# EAGLE design MagMemsAmpli_V6 (EAGLE 9.6.2)
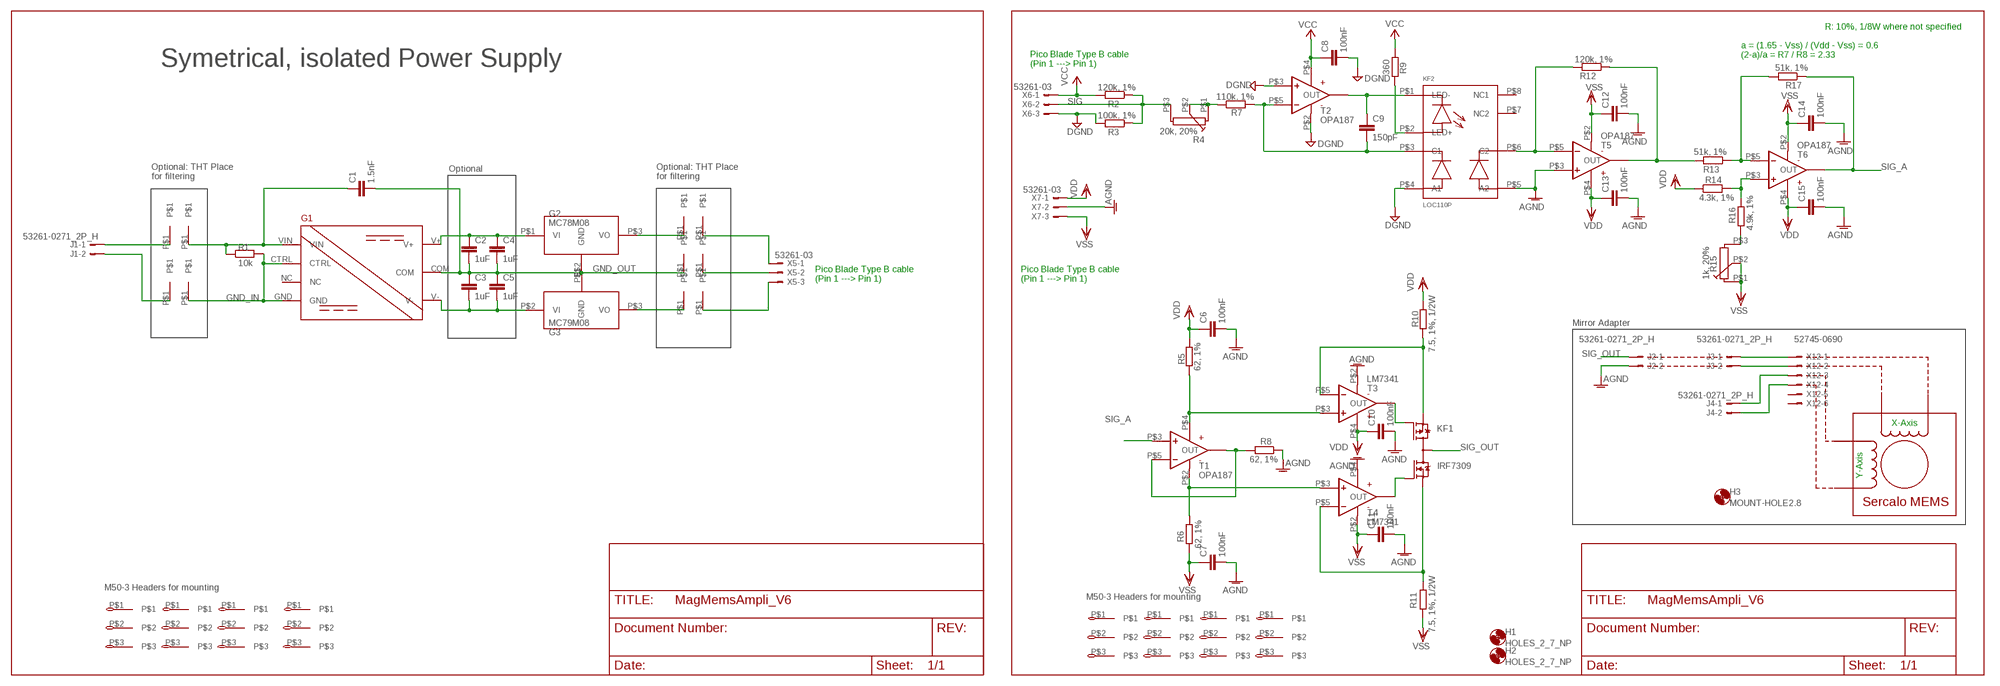
[diagram p0: schematic, sheet 1]

## Parts
C1  1.5nF  C-EUC0805K  [C0805K]
C2  1uF  C-EUC0805K  [C0805K]
C3  1uF  C-EUC0805K  [C0805K]
C4  1uF  C-EUC0805K  [C0805K]
C5  1uF  C-EUC0805K  [C0805K]
C6  100nF  C-EUC0603K  [C0603K]
C7  100nF  C-EUC0603K  [C0603K]
C8  100nF  C-EUC0603K  [C0603K]
C9  150pF  C-EUC0603K  [C0603K]
C10  100nF  C-EUC0603K  [C0603K]
C11  100nF  C-EUC0603K  [C0603K]
C12  100nF  C-EUC0603K  [C0603K]
C13  100nF  C-EUC0603K  [C0603K]
C14  100nF  C-EUC0603K  [C0603K]
C15  100nF  C-EUC0603K  [C0603K]
G1  RS6-0512D  [RS_THT]
G2  MC78M08  [DPAK-3]
G3  MC79M08  [DPAK-3]
H1  HOLES_2_7_NP  [2_7_NP]
H2  HOLES_2_7_NP  [2_7_NP]
H3  MOUNT-HOLE2.8  [2,8]
J1  53261-0271_2P_H  [53261-02]
J2  53261-0271_2P_H  [53261-02]
J3  53261-0271_2P_H  [53261-02]
J4  53261-0271_2P_H  [53261-02]
KF1  IRF7309  [SO08-IRF]
KF2  LOC110P  [LOC110P]
R1  10k  R-EU_R0603  [R0603]
R2  120k, 1%  R-EU_R0603  [R0603]
R3  100k, 1%  R-EU_R0603  [R0603]
R4  20k, 20%  SM-3T  [SM-3T]
R5  62, 1%  R-EU_R0603  [R0603]
R6  62, 1%  R-EU_R0603  [R0603]
R7  110k, 1%  R-EU_R0603  [R0603]
R8  62, 1%  R-EU_R0603  [R0603]
R9  360  R-EU_R0603  [R0603]
R10  7.5, 1%, 1/2W  R-EU_R0805  [R0805]
R11  7.5, 1%, 1/2W  R-EU_R0805  [R0805]
R12  120k, 1%  R-EU_R0603  [R0603]
R13  51k, 1%  R-EU_R0603  [R0603]
R14  4.3k, 1%  R-EU_R0603  [R0603]
R15  1k, 20%  SM-3T  [SM-3T]
R16  4.9k, 1%  R-EU_R0603  [R0603]
R17  51k, 1%  R-EU_R0603  [R0603]
T1  OPA187  [SOT23-5]
T2  OPA187  [SOT23-5]
T3  LM7341  [SOT23-5]
T4  LM7341  [SOT23-5]
T5  OPA187  [SOT23-5]
T6  OPA187  [SOT23-5]
TP1  TP10  [TP10]
TP2  TP10  [TP10]
TP3  TP10  [TP10]
TP4  TP10  [TP10]
TP5  TP10  [TP10]
TP6  TP10  [TP10]
TP7  TP10  [TP10]
TP8  TP10  [TP10]
TP9  TP10  [TP10]
TP10  TP10  [TP10]
X1  M50-3  [M50-3]
X2  M50-3  [M50-3]
X3  M50-3  [M50-3]
X4  M50-3  [M50-3]
X5  53261-03  [53261-03]
X6  53261-03  [53261-03]
X7  53261-03  [53261-03]
X8  M50-3  [M50-3]
X9  M50-3  [M50-3]
X10  M50-3  [M50-3]
X11  M50-3  [M50-3]
X12  52745-0690  [52745-0690]

## Nets
AGND [Thick]: C6.2 C7.2 C10.2 C11.2 C12.2 C13.2 C14.2 C15.2 J2.2 KF2.P$5(A2) R8.1 T3.P$2(V-) T4.P$4(V+) T5.P$3(+IN) X7.2
DGND [Thick]: C8.2 KF2.P$4(A1) R3.2 T2.P$2(V-) T2.P$3(+IN) X6.3
GND_IN [Thick]: G1.CTRL G1.GND R1.2 TP4.P$1
GND_OUT [Thick]: C1.2 C2.2 C3.1 C4.2 C5.1 G1.COM G2.P$2(GND) G3.P$1(GND) TP6.P$1
N$1 [Thick]: C1.1 G1.VIN R1.1 TP3.P$1
N$2 [Thick]: C2.1 C4.1 G1.V+ G2.P$1(VI)
N$3 [Thick]: C3.2 C5.2 G1.V- G3.P$2(VI)
N$4 [Thick]: J1.1 TP1.P$1
N$5: J1.2 TP2.P$1
N$6: C9.1 KF2.P$1(LED-) T2.P$1(OUT)
N$7: KF2.P$2(LED+) R9.1
N$9: R13.1 R17.2 T6.P$5(-IN)
N$10: R12.1 R13.2 T5.P$1(OUT)
N$11: C9.2 KF2.P$3(C1) R7.2 T2.P$5(-IN)
N$12: KF2.P$6(C2) R12.2 T5.P$5(-IN)
N$13: R14.2 R16.2 T6.P$3(+IN)
N$15: G2.P$3(VO) TP5.P$1
N$16: G3.P$3(VO) TP7.P$1
N$17: TP8.P$1 X5.1
N$18: TP9.P$1 X5.2
N$19: TP10.P$1 X5.3
N$30: KF1.3(P-S) R10.1 T3.P$5(-IN)
N$31: KF1.4(P-G) T3.P$1(OUT)
N$32: KF1.2(N-G) T4.P$1(OUT)
N$33: KF1.1(N-S) R11.2 T4.P$5(-IN)
N$34: R8.2 T1.P$1(OUT) T1.P$5(-IN)
N$35: R6.2 T1.P$2(V-) T4.P$3(+IN)
N$36: R5.1 T1.P$4(V+) T3.P$3(+IN)
N$46 [Thin]: J3.1 X12.1
N$47 [Thin]: J3.2 X12.2
N$48 [Thin]: J4.1 X12.3
N$49 [Thin]: J4.2 X12.4
N$59: R4.P$1(1A) R4.P$2(1S) R7.1
N$60: R15.P$3(1E) R16.1
SIG: R2.1 R3.1 R4.P$3(1E) X6.2
SIG_A: R17.1 T1.P$3(+IN) T6.P$1(OUT)
SIG_OUT: J2.1 KF1.5(D) KF1.6(D) KF1.7(D) KF1.8(D)
VCC [Thick]: C8.1 R2.2 R9.2 T2.P$4(V+) X6.1
VDD [Thick]: C6.1 C10.1 C13.1 C15.1 R5.2 R10.2 R14.1 T3.P$4(V+) T5.P$4(V+) T6.P$4(V+) X7.1
VSS [Thick]: C7.1 C11.1 C12.1 C14.1 R6.1 R11.1 R15.P$1(1A) R15.P$2(1S) T4.P$2(V-) T5.P$2(V-) T6.P$2(V-) X7.3
Unconnected: G1.NC KF2.P$7(NC2) KF2.P$8(NC1) X1.P$1 X1.P$2 X1.P$3 X2.P$1 X2.P$2 X2.P$3 X3.P$1 X3.P$2 X3.P$3 X4.P$1 X4.P$2 X4.P$3 X8.P$1 X8.P$2 X8.P$3 X9.P$1 X9.P$2 X9.P$3 X10.P$1 X10.P$2 X10.P$3 X11.P$1 X11.P$2 X11.P$3 X12.5 X12.6

## Notes on the sheet
- R: 10%, 1/8W where not specified
- a = (1.65 - Vss) / (Vdd - Vss) = 0.6
- (2-a)/a = R7 / R8 = 2.33
- Symetrical, isolated Power Supply
- Pico Blade Type B cable
  (Pin 1 ---> Pin 1)
- Optional: THT Place | Optional | Optional: THT Place
- for filtering | for filtering
- Pico Blade Type B cable
  (Pin 1 ---> Pin 1)
- Pico Blade Type B cable
  (Pin 1 ---> Pin 1)
- Mirror Adapter
- X-Axis
- Y-Axis
- M50-3 Headers for mounting
- M50-3 Headers for mounting

## Library data of the parts
C1 = rcl:C-EU: CAPACITOR, European symbol; MOUSER: 0805B152K500CT; PREIS: 0.117; SPICEPREFIX: C
C2-C4 = rcl:C-EU: CAPACITOR, European symbol; MOUSER: 0805B105K500CT; PREIS: 0.199; SPICEPREFIX: C
C5 = rcl:C-EU: CAPACITOR, European symbol; MOUSER: 0805B105K500CT; SPICEPREFIX: C
C6-C8 C10-C15 = rcl:C-EU: CAPACITOR, European symbol; MOUSER: 06033C104KAT4A; PREIS: 0.082; SPICEPREFIX: C
C9 = rcl:C-EU: CAPACITOR, European symbol; MOUSER: C0603C101M5HACTU; PREIS: 0.092; SPICEPREFIX: C
G1 = tud1_eagle_lib:RS6-0512D; IOUT: +-250mA; MANUFACTURER: Recom Power; MOUSER: 919-RS6-0512D; PACKAGE: THT; PREIS: 13.92; TEMP: -40 to 85 deg; UIN: 4.5V-9V; UOUT: +-12V
G2 = tud1_eagle_lib:MC78M08; MOUSER: MC78M08CDTG; PREIS: 0.375
G3 = tud1_eagle_lib:MC79M08; MOUSER: MC79M08CDTG; PREIS: 0.503
H1 H2 = tud1_eagle_lib:HOLES_2_7_NP: Hole D = 2,7mm
H3 = holes:MOUNT-HOLE: MOUNTING HOLE with drill center marker
J1-J4 = tud1_eagle_lib:53261-0271_2P_H: Pin header, PicoBlade 2-pin SMD, 53261-0271, Molex, single row 90, Distrelec : 143-54-270; CABLE_ASSEMBLY_31565: Distrelec : 143-54-490; CONTACT_MATERIAL: Tin-plated phosphor bronze; CONTACT_RESISTANCE: 20mOhm; CRIMP_SOCKET_FEMALE_32-28AWG_50058-8100: Distrelec : 143-00-962; CRIMP_SOCKET_FEMALE__28-26AWG_50079-8100: Distrelec : 143-00-964; DESIGN: Pin strip, single row 90° SMD; DISTRELEC: 143-54-270; MANUFACTURER: Molex; MOUSER: 538-53261-0271; PITCH: 1.25mm; POLE-NO: 2; PREIS: 0.84; RATED-CURRENT: 1A; RATED-VOLTAGE: 125VAC; SERIES: PicoBlade; SOCKET_51021-0200: Distrelec : 143-54-361
KF1 = tud1_eagle_lib:IRF7309: Complimentary Half Bridge HEXFET Power MOSFET Source: http://www.irf.com/product-info/datasheets/data/irf7389.pdf; CHANNELS: N / P; FREILAUFDIODE: YES; IDS: 4A; MANUFACTUR: Infineon; MOUSER: 942-IRF7309TRPBF; PACKAGE: SO-8; PD: 1.4W; PREIS: 0.667; TECH: SS-MOSFET; VDS: 30V
KF2 = tud1_eagle_lib:LOC110P; MOUESR: 849-LOC110P; PREIS: 2.41
R1 = rcl:R-EU_: RESISTOR, European symbol; MOUSER: ESR03EZPF62R0; PREIS: 0.147; SPICEPREFIX: R
R2 R12 = rcl:R-EU_: RESISTOR, European symbol; MOUSER: MCT06030C1203FP500; PREIS: 0.092; SPICEPREFIX: R
R3 = rcl:R-EU_: RESISTOR, European symbol; MOUSER: MCT06030C1003FP500; PREIS: 0.12; SPICEPREFIX: R
R4 = tud1_eagle_lib:SM-3T; MOUSER: SM-3TW203; PREIS: 3.06; TURNS: 11
R5 R6 R8 = rcl:R-EU_: RESISTOR, European symbol; MOUSER: ESR03EZPF62R0; PREIS: 0.119; SPICEPREFIX: R
R7 = rcl:R-EU_: RESISTOR, European symbol; MOUSER: CRCW0603110KFKEAC; PREIS: 0.12; SPICEPREFIX: R
R9 = rcl:R-EU_: RESISTOR, European symbol; MOUSER: MR06X3600FTL; PREIS: 0.12; SPICEPREFIX: R
R10 R11 = rcl:R-EU_: RESISTOR, European symbol; MOUSER: ESR10EZPF7R50; PREIS: 0.147; SPICEPREFIX: R
R13 R17 = rcl:R-EU_: RESISTOR, European symbol; MOUSER: MCT06030C5102FP500; PREIS: 0.137; SPICEPREFIX: R
R14 = rcl:R-EU_: RESISTOR, European symbol; MOUSER: SDR03EZPF4301; PREIS: 0.129; SPICEPREFIX: R
R15 = tud1_eagle_lib:SM-3T; MOUSER: SM-3TW102; PREIS: 3.06; TURNS: 11
R16 = rcl:R-EU_: RESISTOR, European symbol; MOUSER: MCT0603MC4701FP500; PREIS: 0.092; SPICEPREFIX: R
T1 T2 T5 T6 = tud1_eagle_lib:OPA187; GBP: 14MHz; IOUT: +130mA; MANUFACTUR: TI; MOUSER: 595-OPA187IDBVR; OUTPUT_RANGE: Rail-To-Rail; PREIS: 2.06; RUHESTROM: 100uA; TEMO: -40 to 125 deg; VB: +-18V; VCM: Rail-to-Rail
T3 T4 = tud1_eagle_lib:LM7341; GBP: 4MHz; INPUT_RANGE: Rail-To-Rail; MANUFACTUR: TI; MOUSER: 926-LM7341MF/NOPB; OUTPUT_RANGE: Rail-To-Rail; PACKAGE: SOT23-5; PREIS: 2.37; RUHESTROM: 700uA; UMAX: 32V
TP1-TP10 = tud1_eagle_lib:TP10
X1-X4 = tud1_eagle_lib:M50-3; MOUSER: M50-3030342; PREIS: 0.558; TYPE: FEMALE
X5-X7 = con-molex:53?-03: CONNECTOR wire to board 1.25 mm (.049 inch) pitch header; MF: MOLEX; MOUSER: 53261-0371; MPN: 53261-0390; OC_FARNELL: 1125359; OC_NEWARK: 57H5006; PREIS: 0.52
X8-X11 = tud1_eagle_lib:M50-3; MOUSER: M50-3530342; PREIS: 0.137; TYPE: MALE
X12 = con-molex:52745-0690: FFC/FPC-to-Board 0.50mm (.020") SMT Top Contact Right Angle, ZIF, Style Receptacle 52745 / 52435 Source: http://www.molex.com/product/ffc/52745.html; MF: MOLEX; MOUSER: 52745-0697; MPN: 52745-0690; OC_FARNELL: unknown; OC_NEWARK: 92M6374; PREIS: 0.796

## Net classes
0 default: width 0.2 mm, drill 0.3 mm, clearance 0.15 mm
2 Thick: width 0.4 mm, drill 0.6 mm, clearance 0.3 mm
3 Thin: width 0.2 mm, drill 0.3 mm, clearance 0.15 mm

## Board
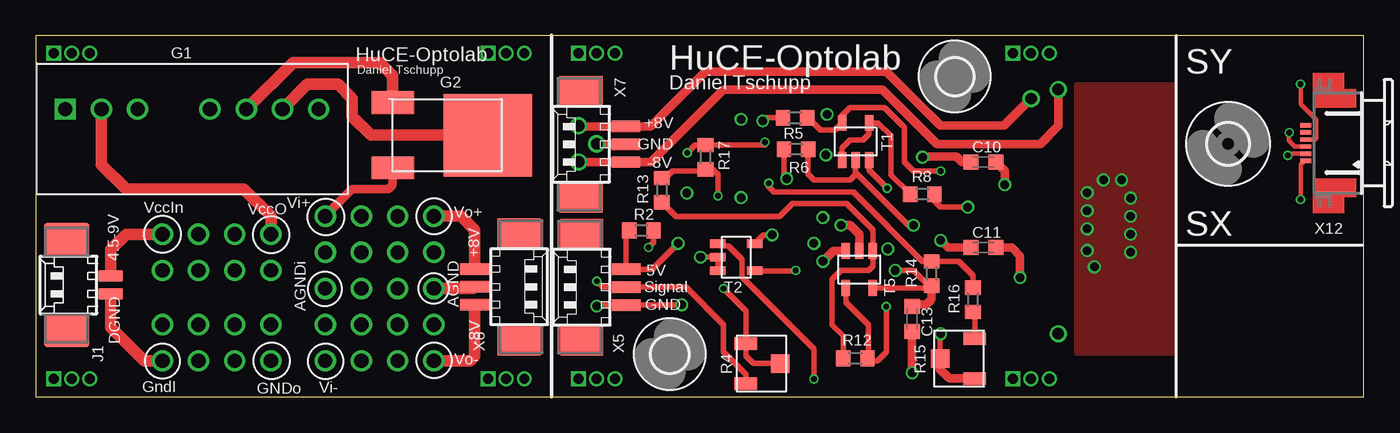
[diagram p1: board, top side]
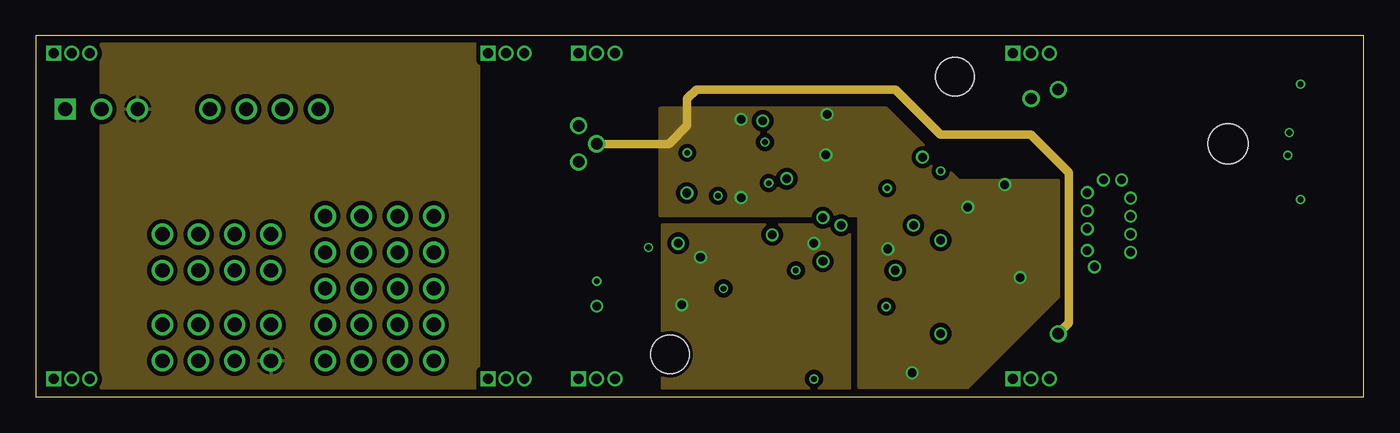
[diagram p2: board, inner layer Route2]
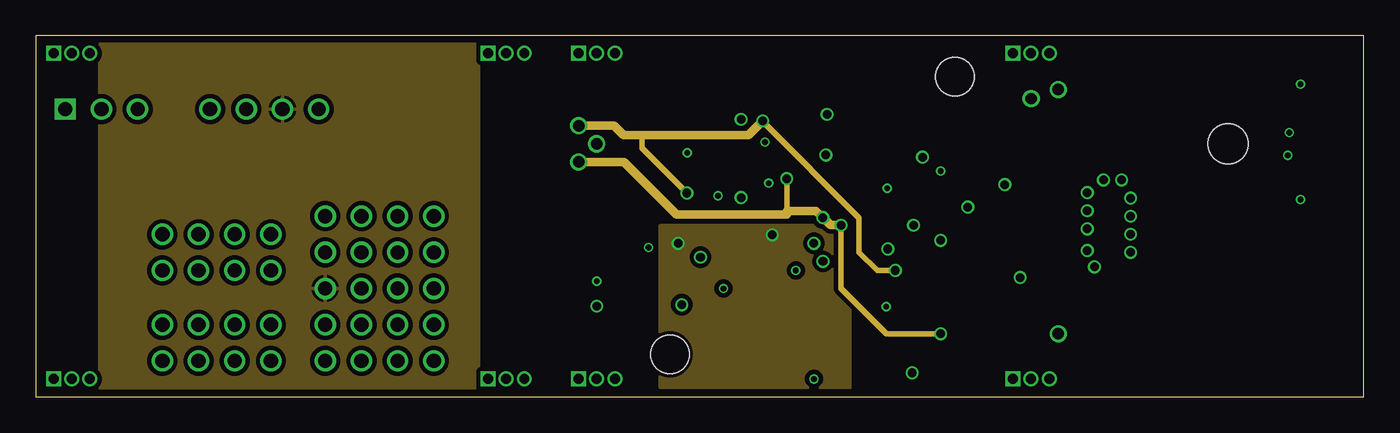
[diagram p3: board, inner layer Route3]
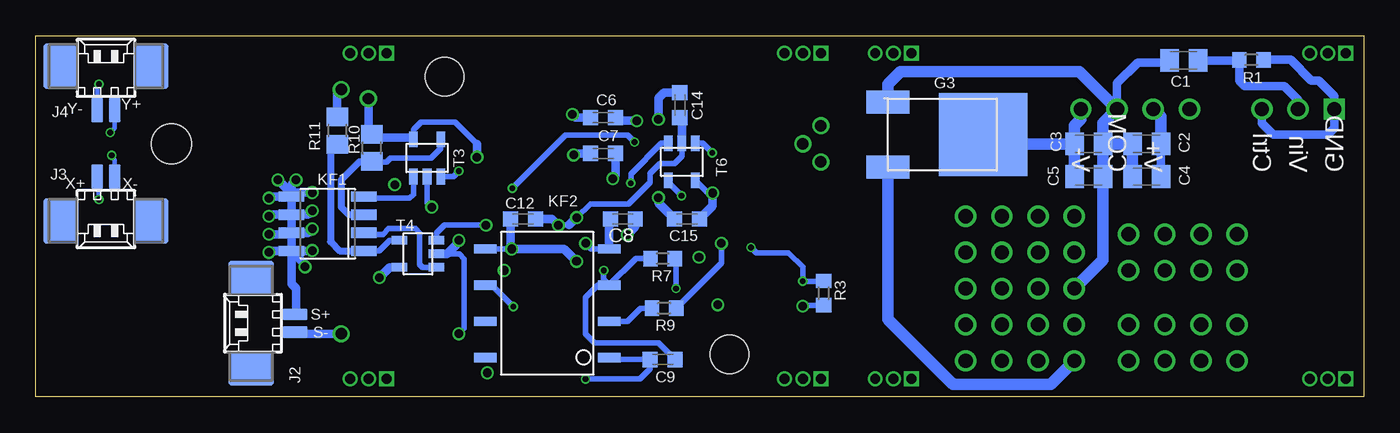
[diagram p4: board, bottom side, seen from below]

Size 93.2 x 25.38 mm. Coordinates in mm from the lower left corner, seen from the top.
Outline: 0,0 93.2,0 93.2,25.38 0,25.38 0,0
Copper layers (1+2*3+16): Top 0.018mm / dielectric 0.36mm / Route2 0.035mm / dielectric 0.71mm / Route3 0.035mm / dielectric 0.36mm / Bottom 0.018mm
Design rules "eC_4Layer_PClass6_BaseCopperO18-I35_eCDefault *": minimum track width 0.15mm, minimum drill 0.35mm, track to track 0.15mm, track to pad 0.15mm, pad to pad 0.15mm, via to via 0.15mm, smd to smd 0mil, copper to edge 0.25mm, drill to drill 0.35mm, minimum pad ring 0.175mm, minimum via ring 0.125mm, stop-mask expansion 0mil, vias tented up to drill 0.45mm, thermal gap 0.2mm

### Footprints (pad centres in the part's own frame; a part is rotated, then mirrored left to right if it is on the bottom)
C0805K = smd 1.3 x 1.6: 1 -1,0; 2 1,0
C0603K = smd 1.05 x 1.08: 1 -0.875,0; 2 0.875,0
RS_THT = drill 1: COM 15.24,0; CTRL 5.08,0; NC 10.16,0; V+ 12.7,0; V- 17.78,0; VIN 2.54,0 | drill 1 square: GND 0,0
DPAK-3 = smd 1.6 x 3: P$1 -2.285,-2.29; P$3 2.285,-2.29 | smd 5.8 x 6.2: P$2 0,4.39
2_7_NP = hole 2.7: 0,0
2,8 = hole 2.8: 0,0
53261-02 = smd 0.8 x 1.7: 1 0.625,-2.35; 2 -0.625,-2.35 | smd 2.3 x 3.2: S1 3.225,0.75; S2 -3.225,0.75
SO08-IRF = smd 0.72 x 1.78: 1 -1.905,-2.543; 2 -0.635,-2.543; 3 0.635,-2.543; 4 1.905,-2.543; 5 1.905,2.543; 6 0.635,2.543; 7 -0.635,2.543; 8 -1.905,2.543
LOC110P = smd 0.65 x 1.55: P$1 -3.81,-4.35; P$2 -1.27,-4.35; P$3 1.27,-4.35; P$4 3.81,-4.35; P$5 3.81,4.35; P$6 1.27,4.35; P$7 -1.27,4.35; P$8 -3.81,4.35
R0603 = smd 1 x 1.1: 1 -0.85,0; 2 0.85,0
SM-3T = smd 0.9 x 1.6: P$1 0,0; P$3 2.8,0 | smd 1.3 x 1.3: P$2 1.4,2.43
R0805 = smd 1.3 x 1.5: 1 -0.95,0; 2 0.95,0
SOT23-5 = smd 1.1 x 0.6: P$1 0,0; P$2 0,-0.95; P$3 0,-1.9; P$4 2.6,0; P$5 2.6,-1.9
TP10 = drill 1: P$1 0,0
M50-3 = drill 0.7 pad 1.016 square: P$1 0,0 | drill 0.7 pad 1.016: P$2 1.27,0; P$3 2.54,0
53261-03 = smd 0.8 x 2: 1 1.25,-2.5; 2 0,-2.5; 3 -1.25,-2.5 | smd 2.1 x 3: S1 3.75,0.625; S2 -3.75,0.625
52745-0690 = smd 0.3 x 0.8: 1 -1.25,2.5; 2 -0.75,2.5; 3 -0.25,2.5; 4 0.25,2.5; 5 0.75,2.5; 6 1.25,2.5

### Placement (x,y rotation side)
C1  12.64,23.64 180 bottom
C2  15.24,17.78 180 bottom
C3  19.3,17.78 180 bottom
C4  15.24,15.49 180 bottom
C5  19.3,15.49 180 bottom
C6  53.37,19.62 180 bottom
C7  53.37,17.1 180 bottom
C8  52,12.5 180 bottom
C9  49.2,2.64 0 bottom
C10  66.5,16.5 0 top
C11  66.5,10.5 0 top
C12  59,12.5 180 bottom
C13  61.5,5.5 270 top
C14  48,20.5 90 bottom
C15  47.5,12.5 180 bottom
G1  2.08,20.22 0 top
G2  27.35,18.38 270 top
G3  31.1,18.43 270 bottom
H1  44.5,3 0 top
H2  64.5,22.5 0 top
H3  83.67,17.77 0 top
J1  2.92,7.87 90 top
J2  77.33,5.18 90 bottom
J3  88.26,13.12 180 bottom
J4  88.26,22.49 0 bottom
KF1  72.7,12.17 90 bottom
KF2  57.3,6.59 90 bottom
R1  7.89,23.68 0 bottom
R2  42.5,11.7 180 top
R3  37.9,7.3 270 bottom
R4  49.83,3.75 270 top
R5  53.29,19.61 180 top
R6  53.35,17.4 0 top
R7  49.2,9.72 180 bottom
R8  62.22,14.25 180 top
R9  49.1,6.24 0 bottom
R10  69.61,17.49 90 bottom
R11  72.03,18.71 270 bottom
R12  57.52,2.72 0 top
R13  43.94,14.52 270 top
R14  62.87,8.67 90 top
R15  65.89,1.3 90 top
R16  65.77,6.83 90 top
R17  47,16.85 270 top
T1  56.58,16.64 90 top
T2  47.87,10.77 0 top
T3  66.68,15.49 90 bottom
T4  65.08,9.11 180 bottom
T5  58.75,10.26 270 top
T6  46.9,17.82 270 bottom
TP1  8.89,11.43 0 top
TP2  8.89,2.54 0 top
TP3  16.51,11.43 0 top
TP4  16.51,2.54 0 top
TP5  20.32,12.7 0 top
TP6  20.32,7.62 0 top
TP7  20.32,2.54 0 top
TP8  27.94,2.54 0 top
TP9  27.94,7.62 0 top
TP10  27.94,12.7 0 top
X1  1.27,1.27 0 top
X2  1.27,24.13 0 top
X3  31.75,1.27 0 top
X4  31.75,24.13 0 top
X5  33.3,7.74 270 top
X6  38.94,7.72 90 top
X7  38.9,17.75 90 top
X8  38.1,24.13 0 top
X9  68.58,24.13 0 top
X10  38.1,1.27 0 top
X11  68.58,1.27 0 top
X12  91.62,17.84 90 top

### Tracks (layer width: path | path; a pad name or v marks a point on that pad's centre or on a via)
AGND  (via drill 0.6, 0.8)
  Top 0.4: v65.41,13.34 63.5,13.34 63.07,13.76 R8.1
  Top 0.6: X7.2 39.4,17.75 v39.37,17.78 | T5.P$3 55.98,10.26 v55.24,9.53 | C13.2 v61.5,1.7 | C10.2 68,15.88 v68,14.92 | C11.2 68.5,10.5 69.08,9.92 v69.08,8.39
  Route2 0.6: v71.75,4.45 72.52,5.21 72.52,15.75 69.85,18.41 63.5,18.41 60.33,21.59 46.35,21.59 45.72,20.95 45.72,19.05 44.45,17.78 v39.37,17.78
  Bottom 0.4: T3.P$2 65.73,13.66 v65.41,13.34 | KF2.P$5 v59.8,10.4
  Bottom 0.6: v71.75,4.45 74.86,4.45 J2.2 | v55.24,9.53 56.12,10.4 v59.8,10.4 59.88,10.47 C12.2 | C14.2 49.12,21.38 49.5,21 v49.5,19.5 | C15.2 49.5,13.62 v49.5,14 | T4.P$4 68.36,9.11 v69.08,8.39 | C6.2 55.3,19.62 v55.53,19.85 | C7.2 55.35,17.1 v55.45,17
  pour Route2: 43.81,12.7 43.81,20.32 59.69,20.32 64.77,15.24 71.75,15.24 71.75,6.99 65.41,0.64 57.78,0.64 57.78,12.7
DGND  (via drill 0.6)
  Top 0.4: v46.65,9.82 T2.P$2 T2.P$3 | v45.34,6.48 42.56,6.48 42.55,6.47 X6.3 39.46,6.47 v39.37,6.38
  Bottom 0.4: KF2.P$4 54.21,10.4 v54.61,10.79 | v39.37,6.38 39.3,6.45 R3.2
  Bottom 0.6: C8.2 52.95,12.43 KF2.P$4
  pour Route2: 43.94,12.06 43.94,0.64 57.15,0.64 57.15,12.06
GND_IN
  Bottom 0.6: R1.2 5.14,23.68 3.68,22.23 3.17,22.23 2.08,21.13 G1.GND 2.08,18.88 2.54,18.41 6.35,18.41 7.16,19.22 G1.CTRL
  pour Route2: 4.57,24.77 4.57,0.64 31.11,0.64 31.11,24.77
GND_OUT
  Top 0.6: G1.COM
  Top 0.8: G2.P$2 23.53,18.38 22.23,19.68 22.23,20.95 21.22,21.96 19.05,21.96 G1.COM
  Bottom 0.6: C1.2 13.78,23.5 15.88,23.5 17.32,22.05 G1.COM
  Bottom 0.8: C3.1 18.3,19.23 G1.COM 19.96,22.86 32.52,22.86 33.39,21.98 G3.P$1 | C3.1 C5.1 18.3,9.64 TP6.P$1 | C3.1 C2.2 C4.2
  pour Route3: 4.45,24.77 4.45,0.64 31.11,0.64 31.11,24.77
N$1
  Top 0.8: TP3.P$1 16.51,12.7 14.61,14.61 6.35,14.61 4.62,16.34 G1.VIN
  Bottom 0.6: G1.VIN 4.62,20.86 5.58,21.82 8.36,21.82 8.74,22.21 R1.1 8.79,23.64 C1.1
N$2
  Top 0.8: G2.P$1 25.06,22.57 24.13,23.5 18.05,23.5 G1.V+
  Bottom 0.6: C4.1 C2.1
  Bottom 0.8: C2.1 14.24,19.68 G1.V+
N$3
  Bottom 0.6: C3.2 20.32,17.8 | G3.P$2 26.06,17.78
  Bottom 0.8: G1.V- 19.86,19.51 20.32,19.05 20.32,17.8 | C5.2 C3.2 26.06,17.78
N$4
  Top 0.8: J1.1 5.27,10.35 6.35,11.43 TP1.P$1
N$5
  Top 0.8: J1.2 5.27,4.89 7.62,2.54 TP2.P$1
N$6  (via drill 0.4)
  Top 0.4: T2.P$1 48.02,10.62 48.62,10.62 49.56,9.68 49.56,8.43 54.61,3.38 v54.61,1.27
  Bottom 0.4: KF2.P$1 52.81,2.64 C9.1 50.07,2 50.8,1.27 v54.61,1.27
N$7
  Bottom 0.4: KF2.P$2 51.68,5.32 50.76,6.24 R9.1
N$9  (via drill 0.4)
  Top 0.4: v47.88,14.13 47.88,15.62 47.5,16 R17.2 46.88,15.88 44.7,15.88 44.2,15.37 R13.1
  Bottom 0.4: T6.P$5 48.8,15.06 v47.88,14.13
N$10
  Top 0.4: R12.1 56.67,4.29 55.88,5.08 55.88,8.26 56.52,8.89 58.42,8.89 58.75,9.22 T5.P$1 58.75,11.74 56.91,13.57 53.1,13.57 52.2,12.68 44.94,12.68 R13.2
N$11  (via drill 0.4)
  Top 0.4: T2.P$5 53.32,8.87 v53.34,8.89
  Bottom 0.4: KF2.P$3 51.09,9.72 R7.2 | C9.2 49.5,3.81 50.16,3.81 53.98,3.81 54.61,4.45 54.61,6.99 53.74,7.86 KF2.P$3 | v53.34,8.89 53.34,8.25 KF2.P$3
N$12  (via drill 0.4)
  Top 0.4: T5.P$5 56.85,6.65 58.42,5.08 58.42,2.77 | 58.42,2.77 R12.2 | 58.42,2.77 58.65,2.54 59.05,2.54 59.69,3.17 v59.69,6.35
  Bottom 0.4: KF2.P$6 61.2,7.86 v59.69,6.35
N$13  (via drill 0.4)
  Top 0.4: v51.44,15.02 51.44,14.77 51.82,14.38 57.37,14.38 62.23,9.53 R14.2 64.77,9.52 65.77,8.52 R16.2
  Bottom 0.4: T6.P$3 49.27,17.82 51.44,15.65 v51.44,15.02
N$15
  Top 0.6: TP5.P$1 22.23,14.61 24.77,14.61 25.06,14.9 G2.P$3
N$16
  Bottom 0.8: TP7.P$1 21.97,0.89 28.83,0.89 33.39,5.45 G3.P$3
N$17
  Top 0.8: X5.1 30.8,2.86 30.48,2.54 TP8.P$1
N$18
  Top 0.6: X5.2 30.68,7.62
  Top 0.8: 30.68,7.62 TP9.P$1
N$19
  Top 0.8: X5.3 30.8,11.74 29.84,12.7 TP10.P$1
N$20  (via drill 1)
  other vias: 22.86,12.7
N$21  (via drill 1)
  other vias: 25.4,12.7
N$22  (via drill 1)
  other vias: 27.94,10.16
N$23  (via drill 1)
  other vias: 25.4,10.16
N$24  (via drill 1)
  other vias: 22.86,10.16
N$25  (via drill 1)
  other vias: 20.32,10.16
N$26  (via drill 1)
  other vias: 16.51,5.08
N$27  (via drill 1)
  other vias: 22.86,7.62
N$28  (via drill 1)
  other vias: 25.4,7.62
N$29  (via drill 1)
  other vias: 27.94,5.08
N$30
  Bottom 0.4: T3.P$5 64.78,17.45 65.45,16.79 68.31,16.79 68.58,16.51 69.85,16.51
  Bottom 0.508: R10.1 69.64,16.51 69.85,16.51 70.48,16.51 71.75,15.24 71.75,13.34 71.22,12.8 KF1.3
N$31
  Bottom 0.4: T3.P$1 66.68,14.23 66.94,13.97 70.06,13.97 KF1.4
N$32
  Bottom 0.4: KF1.2 70.06,11.43 68.83,11.43 68.44,11.82 66.55,11.82 66.26,11.53 66.26,9.3 66.06,9.11 T4.P$1
N$33
  Bottom 0.4: KF1.1 69.11,10.26 68.37,11.01 T4.P$5
  Bottom 0.508: R11.2 72.52,17.28 72.52,10.92 71.86,10.26 KF1.1
N$34
  Top 0.4: T1.P$1 56.58,17.47 57.15,18.03 58.04,18.03 58.48,18.48 T1.P$5 59.12,19.25 60.02,18.34 60.02,15.6 R8.2
N$35  (via drill 0.6)
  Top 0.4: v61.59,12.06 61.21,12.06 57.6,15.68 | 57.6,15.68 57.53,15.75 T1.P$2 | R6.2 54.2,15.65 54.61,15.24 57.15,15.24 57.6,15.68
  Bottom 0.4: T4.P$3 65.07,11.02 65.07,11.52 64.52,12.06 v61.59,12.06
N$36  (via drill 0.4)
  Top 0.4: v63.5,15.88 61.59,15.88 60.96,16.51 60.96,18.93 59.58,20.32 57.15,20.32 56.58,19.75 T1.P$4 56.08,18.75 55.06,18.75 54.2,19.61 R5.1
  Bottom 0.4: v63.5,15.88 63.89,15.49 T3.P$3
N$37  (via drill 1)
  other vias: 25.4,5.08
N$38  (via drill 1)
  other vias: 22.86,5.08
N$39  (via drill 1)
  other vias: 20.32,5.08
N$40  (via drill 1)
  other vias: 22.86,2.54
N$41  (via drill 1)
  other vias: 25.4,2.54
N$42  (via drill 1)
  other vias: 11.43,11.43
N$43  (via drill 1)
  other vias: 13.97,11.43
N$44  (via drill 1)
  other vias: 16.51,8.89
N$45  (via drill 1)
  other vias: 13.97,8.89
N$46  (via drill 0.4)
  Top 0.3: X12.1 89.02,16.59 88.77,16.33 v88.77,13.87
  Bottom 0.3: v88.77,13.87 88.77,15.35 J3.1
N$47  (via drill 0.4)
  Top 0.3: X12.2 87.98,17.09 v87.86,16.97
  Bottom 0.3: v87.86,16.97 87.86,16.87 87.64,16.64 J3.2
N$48  (via drill 0.4)
  Top 0.3: v87.97,18.57 87.92,18.53 87.92,18.01 88.35,17.59 X12.3
  Bottom 0.3: v87.97,18.57 87.64,18.9 J4.1
N$49  (via drill 0.4)
  Top 0.3: X12.4 89.78,18.09 89.86,18.17 89.86,19.47 88.77,20.57 v88.77,21.97
  Bottom 0.3: v88.77,21.97 88.89,21.85 J4.2
N$50  (via drill 1)
  other vias: 11.43,8.89
N$51  (via drill 1)
  other vias: 8.89,8.89
N$52  (via drill 1)
  other vias: 8.89,5.08
N$53  (via drill 1)
  other vias: 11.43,5.08
N$54  (via drill 1)
  other vias: 13.97,5.08
N$55  (via drill 1)
  other vias: 13.97,2.54
N$56  (via drill 1)
  other vias: 11.43,2.54
N$59  (via drill 0.4)
  Top 0.4: v48.26,7.62 49.83,6.05 49.83,4.45 R4.P$1 49.83,2.88 50.35,2.35 R4.P$2
  Bottom 0.4: v48.26,7.62 48.26,9.63 R7.1
N$60
  Top 0.4: R15.P$3 65.89,5.86 R16.1
SIG  (via drill 0.4)
  Top 0.4: R4.P$3 49.83,1.61 48.26,3.17 48.26,5.08 45.62,7.72 X6.2 39.78,7.72 v39.37,8.13 | R2.1 43.35,10.85 v43,10.5
  Bottom 0.4: R3.1 37.92,8.13 v39.37,8.13 39.37,9.13 40.37,10.13 42.63,10.13 v43,10.5
SIG_A  (via drill 0.4)
  Top 0.4: v51.18,17.91 51.18,17.7 R17.1 46.27,17.7 v45.72,17.14 | v59.75,14.66 58.48,15.93 T1.P$3
  Bottom 0.4: v51.18,17.91 51.68,18.41 56,18.41 v59.75,14.66 | v45.72,17.14 46.39,17.82 T6.P$1
SIG_OUT  (via drill 0.6)
  Bottom 0.6: KF1.5 KF1.6 | KF1.6 KF1.7 | KF1.7 KF1.8 | KF1.8 75.25,7.94 74.93,7.62 74.93,5.86 J2.1 | KF1.5 75.25,14.29 v76.2,15.24 | KF1.5 75.25,14.92 v74.93,15.24 | KF1.5 76.73,14.07 v76.83,13.97 | KF1.6 76.73,12.8 v76.83,12.7 | KF1.7 75.35,11.43 v76.83,11.43 | KF1.8 76.73,10.26 v76.83,10.16 | KF1.5 74.97,14.35 v73.79,14.35 | KF1.6 74.06,12.8 v73.79,13.08 | KF1.7 74.06,11.53 v73.79,11.81 | KF1.8 73.81,10.26 v73.79,10.29 | KF1.8 74.3,9.31 v74.3,9.14
  pour Top (no thermals): 73,22 80,22 80,3 73,3
VCC  (via drill 0.6)
  Top 0.4: v45.09,10.79 43.26,8.97 X6.1 41.44,11.49 R2.2 | T2.P$4 51.09,11.39 v51.69,11.39
  Bottom 0.4: R9.2 45.09,9.4 v45.09,10.79
  Bottom 0.6: v51.69,11.39 51.12,11.96 C8.1
  pour Route3: 43.81,12.06 57.15,12.06 57.15,0.64 43.81,0.64
VDD  (via drill 0.6, 0.8)
  Top 0.4: R5.2 51.23,19.61 v51.02,19.4 | T5.P$4 62.7,7.66 R14.1 62.66,7.82 61.59,8.89 v60.33,8.89
  Top 0.6: v69.85,20.95 67.94,19.05 63.5,19.05 59.69,22.86 46.99,22.86 43.13,19 X7.1 38.15,19 v38.1,19.05 | C13.1 61.62,6.5 62.5,6.5 62.87,6.87 R14.1 | C10.1 65,16.5 64.62,16.88 62.27,16.88 v62.23,16.84
  Route3 0.4: v60.33,8.89 59.05,8.89 57.78,10.16 57.78,12.57 51.02,19.34 v51.02,19.4 | v45.7,14.32 42.55,17.48 42.55,18.4
  Route3 0.6: v38.1,19.05 40.6,19.05 41.25,18.4 42.55,18.4 50.02,18.4 v51.02,19.4
  Bottom 0.4: T3.P$4 66.67,18.22 66.67,18.8 66.17,19.3 63.75,19.3 62.23,17.78 | T6.P$4 46.01,14.32 v45.7,14.32
  Bottom 0.6: v69.85,20.95 69.85,18.68 R10.2 69.39,18.22 66.67,18.22 | 62.23,17.78 v62.23,16.84 | v45.7,14.32 45.7,13.43 C15.1 | C6.1 52.27,19.4 v51.02,19.4
VSS  (via drill 0.6, 0.8)
  Top 0.4: R6.1 52.5,15.54 v52.7,15.34 | R15.P$2 63.46,4.41 v63.5,4.45
  Top 0.6: v71.75,21.59 71.75,19.05 70.48,17.78 63.25,17.78 59.44,21.59 48.26,21.59 43.17,16.5 X7.3 38.11,16.5 v38.1,16.51 | R15.P$1 64.11,1.3 63.46,1.95 R15.P$2 | T5.P$2 57.8,11.42 57.15,12.06 v56.52,12.06 | C11.1 64,10.5 v63.5,11
  Route3 0.4: v52.7,15.34 52.7,13.07 52.7,12.8 | v63.5,4.45 59.69,4.45 56.52,7.62 v56.52,12.06
  Route3 0.6: v38.1,16.51 41.27,16.51 44.98,12.8 52.7,12.8 | v56.52,12.06 55.77,12.06 v55.24,12.6 54.77,13.07 52.7,13.07
  Bottom 0.4: T6.P$2 47.85,16.92 48.39,16.38 49.4,16.38 50.1,15.69 50.1,15.05 51.59,13.56 54.28,13.56 v55.24,12.6 | 55.77,12.06 v56.52,12.06 | T4.P$2 65.05,10.03 63.45,10.03 63.12,9.71 63.12,4.83 v63.5,4.45
  Bottom 0.6: v71.75,21.59 72.03,21.31 R11.1 | 55.77,12.06 v55.24,12.6 | C12.1 56.95,12.5 v56.52,12.06 | T6.P$2 47.85,19.48 C14.1 | v63.5,11 63.5,10.88 64.33,10.06 T4.P$2 | C7.1 52.5,16 52.5,15.54 v52.7,15.34

### Text on the board
tPlace: HuCE-Optolab | Daniel Tschupp | HuCE-Optolab | SY | Daniel Tschupp | +8V | GND | -8V | VccIn | VccO | Vi+ | Vo+ | SX | 4.5-9V | +8V | 5V | Signal | AGNDi | AGND | GND | DGND | -8V | Vo- | GndI | GNDo | Vi-
bPlace: Y+ | Y- | X- | X+ | S+ | S-